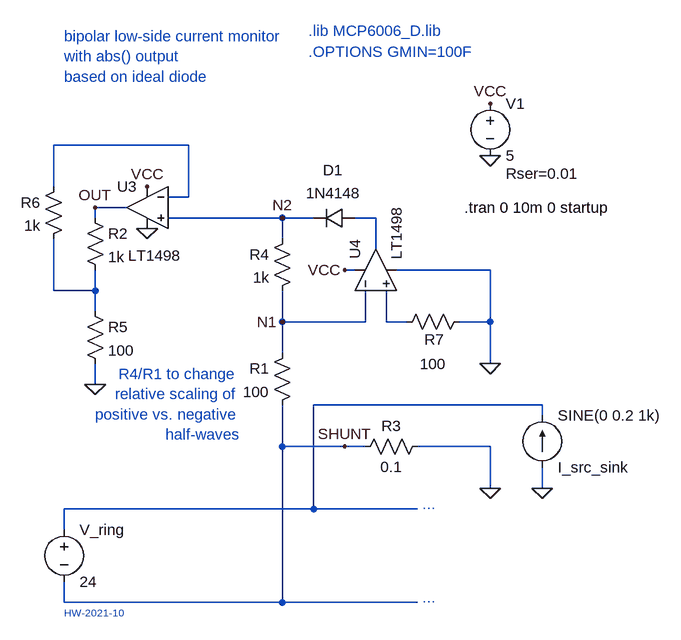
[diagram p0: schematic bipolar LS current monitor.asc]
bipolar LS current monitor.asc, the LTspice schematic file:
Version 4
SHEET 1 880 944
WIRE 16 160 -192 160
WIRE -192 224 -192 160
WIRE 16 240 16 160
WIRE 16 240 -16 240
WIRE -80 256 -128 256
WIRE -128 272 -128 256
WIRE 160 272 -16 272
WIRE 208 272 160 272
WIRE 304 272 272 272
WIRE 160 304 160 272
WIRE 304 320 304 272
WIRE 272 352 256 352
WIRE 480 352 336 352
WIRE -192 384 -192 304
WIRE -128 384 -128 352
WIRE -128 384 -192 384
WIRE -128 416 -128 384
WIRE 160 432 160 384
WIRE 288 432 288 384
WIRE 288 432 160 432
WIRE 320 432 320 384
WIRE 352 432 320 432
WIRE 480 432 480 352
WIRE 480 432 432 432
WIRE 160 480 160 432
WIRE 480 496 480 432
WIRE -128 528 -128 496
WIRE 560 560 208 560
WIRE 560 576 560 560
WIRE 160 624 160 560
WIRE 256 624 160 624
WIRE 288 624 256 624
WIRE 480 624 368 624
WIRE 480 688 480 624
WIRE 560 688 560 656
WIRE 208 720 208 560
WIRE 208 720 -176 720
WIRE 368 720 208 720
WIRE -176 752 -176 720
WIRE -176 864 -176 832
WIRE 160 864 160 624
WIRE 160 864 -176 864
WIRE 368 864 160 864
FLAG 480 176 0
FLAG 480 496 0
FLAG 480 96 VCC
FLAG 256 352 VCC
FLAG 480 688 0
FLAG 560 688 0
FLAG 256 624 SHUNT
FLAG -48 224 VCC
FLAG -48 288 0
FLAG -128 528 0
FLAG -128 256 OUT
FLAG 160 432 N1
FLAG 160 272 N2
SYMBOL res 176 464 M0
SYMATTR InstName R1
SYMATTR Value 100
SYMBOL res 384 608 R90
WINDOW 0 0 56 VBottom 2
WINDOW 3 32 56 VTop 2
SYMATTR InstName R3
SYMATTR Value 0.1
SYMBOL voltage 480 80 R0
WINDOW 123 0 0 Left 0
WINDOW 39 24 124 Left 2
SYMATTR SpiceLine Rser=0.01
SYMATTR InstName V1
SYMATTR Value 5
SYMBOL current 560 656 M180
WINDOW 123 0 0 Left 0
WINDOW 39 0 0 Left 0
SYMATTR InstName I_src_sink
SYMATTR Value SINE(0 0.2 1k)
SYMBOL res 176 288 M0
SYMATTR InstName R4
SYMATTR Value 1k
SYMBOL res -144 256 R0
SYMATTR InstName R2
SYMATTR Value 1k
SYMBOL res -144 400 R0
SYMATTR InstName R5
SYMATTR Value 100
SYMBOL res 448 416 R90
WINDOW 0 59 54 VBottom 2
WINDOW 3 65 56 VTop 2
SYMATTR InstName R7
SYMATTR Value 100
SYMBOL diode 272 256 R90
WINDOW 0 -42 34 VBottom 2
WINDOW 3 -38 33 VTop 2
SYMATTR InstName D1
SYMATTR Value 1N4148
SYMBOL Opamps\\LT1498 -48 192 M0
WINDOW 3 -53 138 Left 2
SYMATTR InstName U3
SYMBOL Opamps\\LT1498 240 352 R270
SYMATTR InstName U4
SYMBOL voltage -176 736 R0
WINDOW 123 0 0 Left 0
WINDOW 39 0 0 Left 0
SYMATTR InstName V_ring
SYMATTR Value 24
SYMBOL res -176 208 M0
SYMATTR InstName R6
SYMATTR Value 1k
TEXT 440 256 Left 2 !.tran 0 10m 0 startup
TEXT -176 -8 Left 2 ;bipolar low-side current monitor\nwith abs() output\nbased on ideal diode
TEXT 96 512 Right 2 ;R4/R1 to change \nrelative scaling of \npositive vs. negative \nhalf-waves
TEXT 200 -16 Left 2 ;.lib MCP6006_D.lib
TEXT 200 16 Left 2 ;.OPTIONS GMIN=100F
TEXT -176 880 Left 1 ;HW-2021-10
TEXT 376 856 Left 2 ;...
TEXT 376 712 Left 2 ;...

The netlist it stands for:
* bipolar LS current monitor.asc
R1 N1 SHUNT 100
R3 0 SHUNT 0.1
V1 VCC 0 5 Rser=0.01
I_src_sink 0 N005 SINE(0 0.2 1k)
R4 N2 N1 1k
R2 OUT N003 1k
R5 N003 0 100
R7 0 N004 100
D1 N002 N2 1N4148
XU3 N2 N001 VCC 0 OUT LT1498  ; pins In+ In- V+ V- OUT
XU4 N004 N1 VCC 0 N002 LT1498  ; pins In+ In- V+ V- OUT
V_ring N005 SHUNT 24
R6 N001 N003 1k
.model D D
.lib standard.dio
.tran 0 10m 0 startup
* bipolar low-side current monitor
* with abs() output
* based on ideal diode
* R4/R1 to change
* relative scaling of
* positive vs. negative
* half-waves
* .lib MCP6006_D.lib
* .OPTIONS GMIN=100F
* HW-2021-10
* ...
* ...
.lib LTC.lib
.backanno
.end